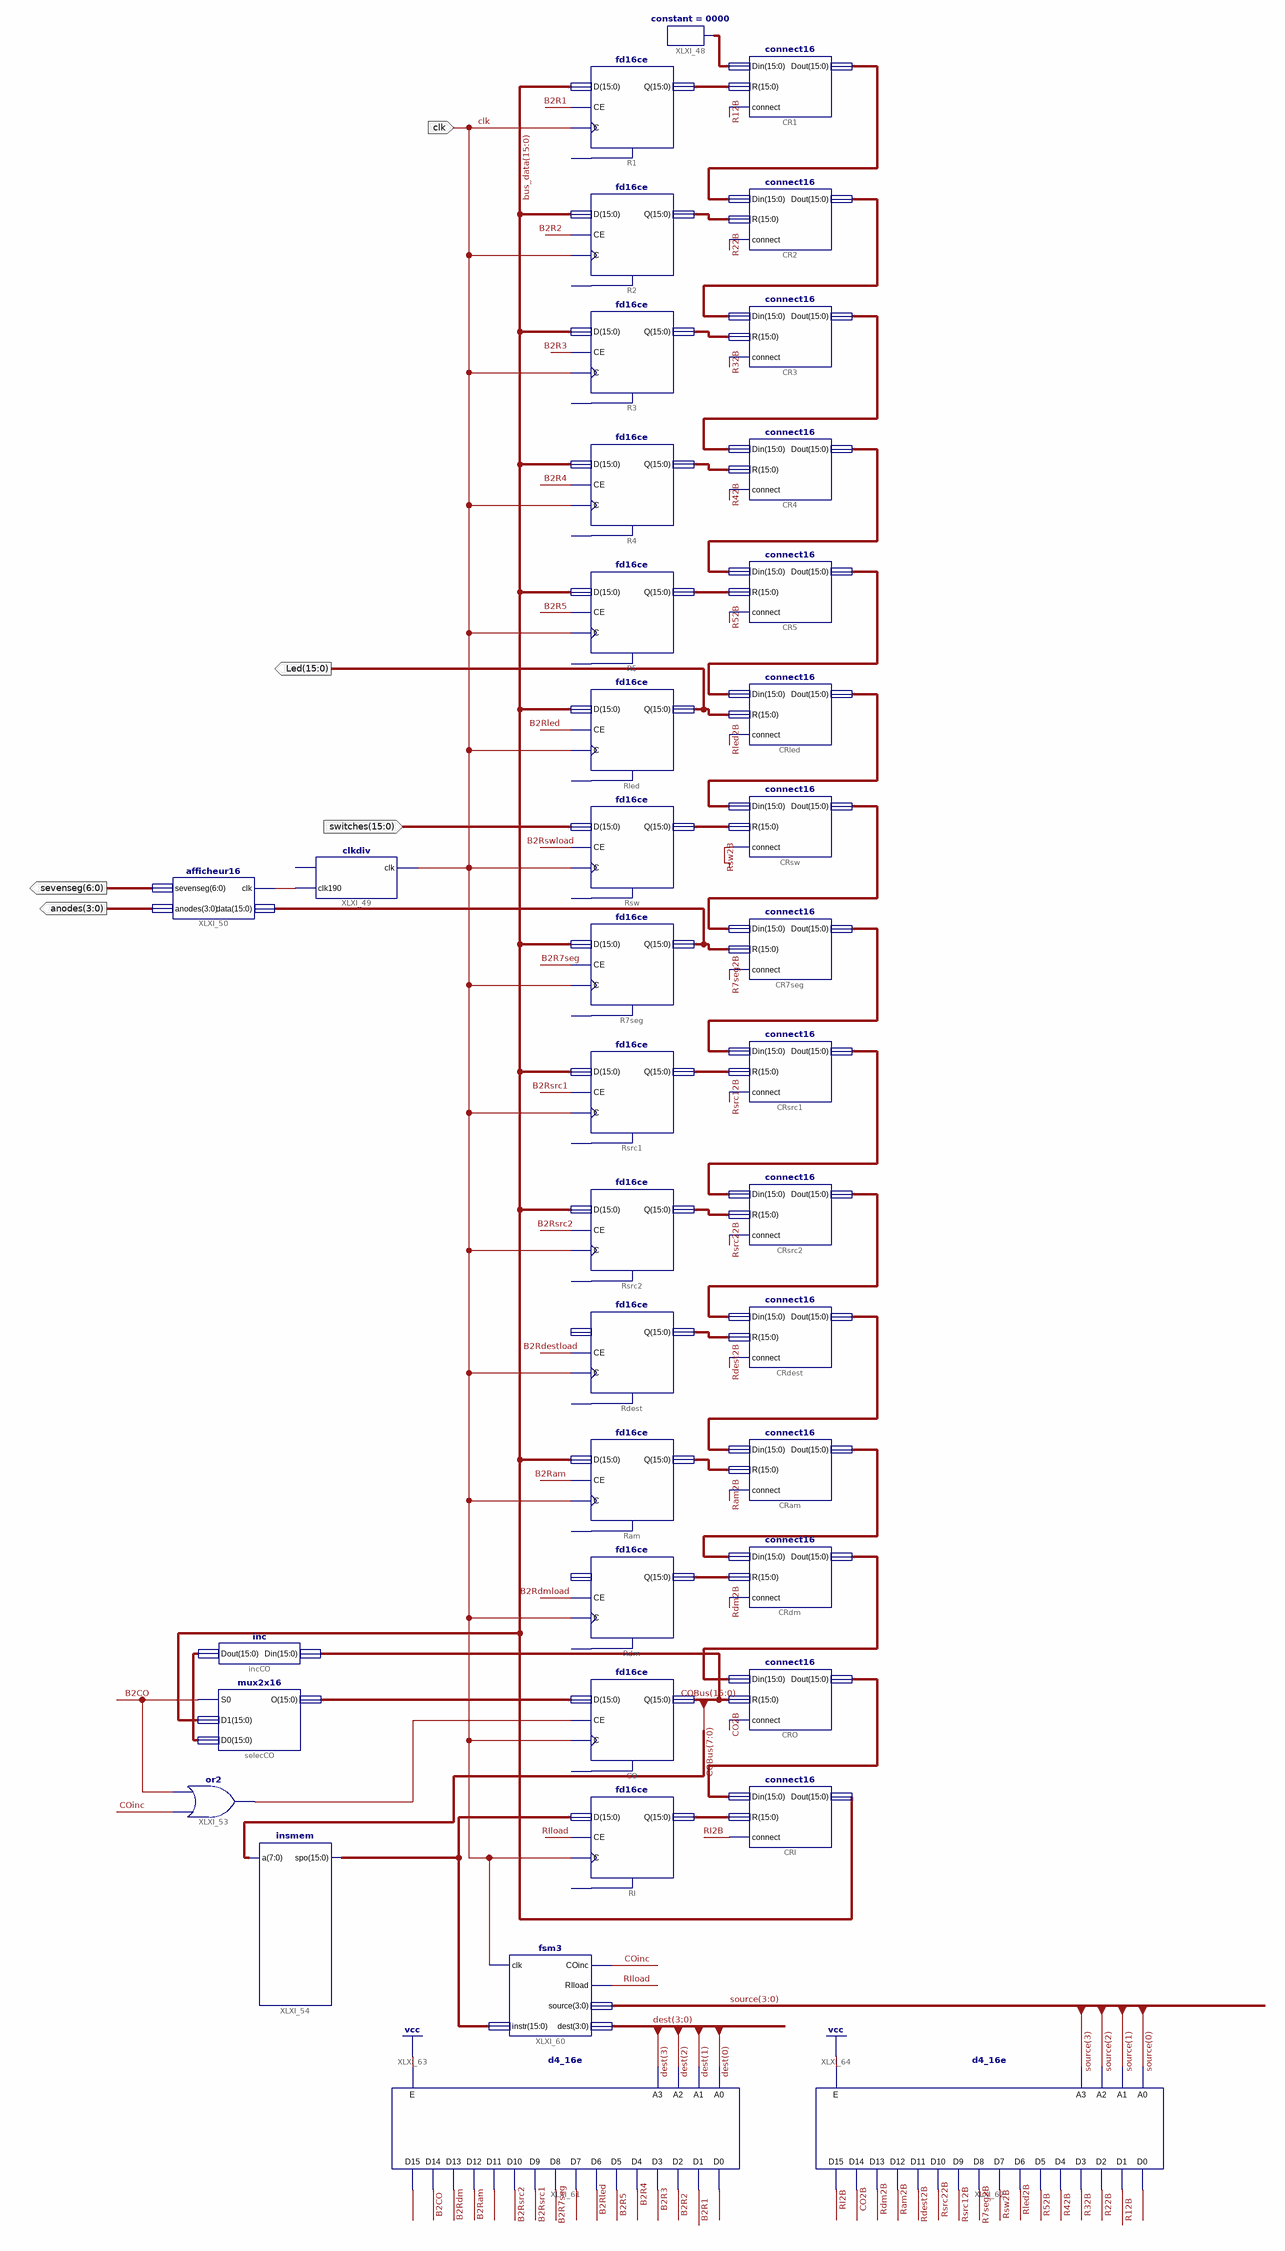
[diagram p0: schematic sheet 1]
// Xilinx ISE schematic S3.sch (spartan3e) as structural Verilog: 40 symbols, 5 ports
module S3 (
  input  clk,
  input  [15:0] switches,
  output [15:0] Led,
  output [3:0] anodes,
  output [6:0] sevenseg
);

  wire B2CO, B2R1, B2R2, B2R3, B2R4, B2R5, B2R7seg, B2Ram, B2Rdestload, B2Rdm, B2Rdmload, B2Rled, B2Rsrc1,
       B2Rsrc2, B2Rswload, CO2B, COinc, R7seg2B, R12B, R22B, R32B, R42B, R52B, Ram2B, Rdest2B, Rdm2B, RI2B,
       RIload, Rled2B, Rsrc12B, Rsrc22B, Rsw2B, XLXN_79, XLXN_85, XLXN_105, XLXN_109, XLXN_113, XLXN_120,
       XLXN_136;
  wire [3:0] dest, source;
  wire [15:0] bus_data, COBus, XLXN_1, XLXN_2, XLXN_3, XLXN_4, XLXN_5, XLXN_7, XLXN_8, XLXN_9, XLXN_10,
       XLXN_11, XLXN_12, XLXN_13, XLXN_15, XLXN_31, XLXN_32, XLXN_33, XLXN_34, XLXN_35, XLXN_36, XLXN_37,
       XLXN_38, XLXN_39, XLXN_40, XLXN_41, XLXN_42, XLXN_43, XLXN_45, XLXN_46, XLXN_80, XLXN_89, XLXN_102;

  fd16ce R1 (.C(clk), .CE(B2R1), .D(bus_data), .Q(XLXN_1));  // open: CLR
  fd16ce R2 (.C(clk), .CE(B2R2), .D(bus_data), .Q(XLXN_2));  // open: CLR
  fd16ce R3 (.C(clk), .CE(B2R3), .D(bus_data), .Q(XLXN_3));  // open: CLR
  fd16ce R4 (.C(clk), .CE(B2R4), .D(bus_data), .Q(XLXN_4));  // open: CLR
  fd16ce R5 (.C(clk), .CE(B2R5), .D(bus_data), .Q(XLXN_5));  // open: CLR
  fd16ce Rled (.C(clk), .CE(B2Rled), .D(bus_data), .Q(Led));  // open: CLR
  fd16ce Rsw (.C(clk), .CE(B2Rswload), .D(switches), .Q(XLXN_7));  // open: CLR
  fd16ce R7seg (.C(clk), .CE(B2R7seg), .D(bus_data), .Q(XLXN_8));  // open: CLR
  fd16ce Rsrc1 (.C(clk), .CE(B2Rsrc1), .D(bus_data), .Q(XLXN_9));  // open: CLR
  fd16ce Rsrc2 (.C(clk), .CE(B2Rsrc2), .D(bus_data), .Q(XLXN_10));  // open: CLR
  fd16ce Rdest (.C(clk), .CE(B2Rdestload), .Q(XLXN_11));  // open: CLR, D
  fd16ce Ram (.C(clk), .CE(B2Ram), .D(bus_data), .Q(XLXN_12));  // open: CLR
  fd16ce Rdm (.C(clk), .CE(B2Rdmload), .Q(XLXN_13));  // open: CLR, D
  fd16ce CO (.C(clk), .CE(XLXN_85), .D(XLXN_89), .Q(COBus));  // open: CLR
  fd16ce RI (.C(clk), .CE(RIload), .D(XLXN_102), .Q(XLXN_15));  // open: CLR
  connect16 CR1 (.Din(XLXN_46), .R(XLXN_1), .connect(R12B), .Dout(XLXN_31));
  connect16 CR2 (.Din(XLXN_31), .R(XLXN_2), .connect(R22B), .Dout(XLXN_32));
  connect16 CR3 (.Din(XLXN_32), .R(XLXN_3), .connect(R32B), .Dout(XLXN_33));
  connect16 CR4 (.Din(XLXN_33), .R(XLXN_4), .connect(R42B), .Dout(XLXN_34));
  connect16 CR5 (.Din(XLXN_34), .R(XLXN_5), .connect(R52B), .Dout(XLXN_35));
  connect16 CRled (.Din(XLXN_35), .R(Led), .connect(Rled2B), .Dout(XLXN_36));
  connect16 CRsw (.Din(XLXN_36), .R(XLXN_7), .connect(Rsw2B), .Dout(XLXN_37));
  connect16 CR7seg (.Din(XLXN_37), .R(XLXN_8), .connect(R7seg2B), .Dout(XLXN_39));
  connect16 CRsrc1 (.Din(XLXN_39), .R(XLXN_9), .connect(Rsrc12B), .Dout(XLXN_38));
  connect16 CRsrc2 (.Din(XLXN_38), .R(XLXN_10), .connect(Rsrc22B), .Dout(XLXN_40));
  connect16 CRdest (.Din(XLXN_40), .R(XLXN_11), .connect(Rdest2B), .Dout(XLXN_41));
  connect16 CRam (.Din(XLXN_41), .R(XLXN_12), .connect(Ram2B), .Dout(XLXN_42));
  connect16 CRdm (.Din(XLXN_42), .R(XLXN_13), .connect(Rdm2B), .Dout(XLXN_43));
  connect16 CRO (.Din(XLXN_43), .R(COBus), .connect(CO2B), .Dout(XLXN_45));
  constant #(.CValue("0000")) XLXI_48 (.O(XLXN_46));
  clkdiv XLXI_49 (.clk(clk), .clk190(XLXN_79));  // open: clksec
  afficheur16 XLXI_50 (.clk(XLXN_79), .data(XLXN_8), .sevenseg(sevenseg), .anodes(anodes));
  inc incCO (.Din(COBus), .Dout(XLXN_80));
  mux2x16 selecCO (.S0(B2CO), .D1(bus_data), .D0(XLXN_80), .O(XLXN_89));
  or XLXI_53 (XLXN_85, COinc, B2CO);
  insmem XLXI_54 (.a(COBus[7:0]), .spo(XLXN_102));
  connect16 CRI (.Din(XLXN_45), .R(XLXN_15), .connect(RI2B), .Dout(bus_data));
  fsm3 XLXI_60 (.clk(clk), .instr(XLXN_102), .COinc(COinc), .RIload(RIload), .source(source), .dest(dest));
  d4_16e XLXI_61 (
    .A0(dest[0]), .A1(dest[1]), .A2(dest[2]), .A3(dest[3]), .E(1'b1), .D0(XLXN_120), .D1(B2R1),
    .D10(B2Rsrc2), .D11(XLXN_109), .D12(B2Ram), .D13(B2Rdm), .D14(B2CO), .D15(XLXN_105), .D2(B2R2),
    .D3(B2R3), .D4(B2R4), .D5(B2R5), .D6(B2Rled), .D7(XLXN_113), .D8(B2R7seg), .D9(B2Rsrc1));
  d4_16e XLXI_62 (
    .A0(source[0]), .A1(source[1]), .A2(source[2]), .A3(source[3]), .E(1'b1), .D0(XLXN_136), .D1(R12B),
    .D10(Rsrc22B), .D11(Rdest2B), .D12(Ram2B), .D13(Rdm2B), .D14(CO2B), .D15(RI2B), .D2(R22B), .D3(R32B),
    .D4(R42B), .D5(R52B), .D6(Rled2B), .D7(Rsw2B), .D8(R7seg2B), .D9(Rsrc12B));
endmodule
